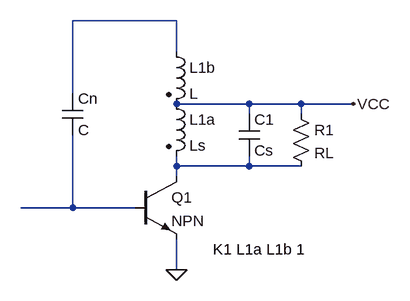
[diagram p0: schematic Estab_base.asc]
Estab_base.asc, the LTspice schematic file:
Version 4
SHEET 1 880 680
WIRE 192 -80 32 -80
WIRE 192 -32 192 -80
WIRE 32 32 32 -80
WIRE 304 48 192 48
WIRE 384 48 304 48
WIRE 464 48 384 48
WIRE 304 64 304 48
WIRE 384 64 384 48
WIRE 192 144 192 128
WIRE 304 144 304 128
WIRE 304 144 192 144
WIRE 384 144 304 144
WIRE 192 160 192 144
WIRE 32 208 32 96
WIRE 32 208 -48 208
WIRE 128 208 32 208
WIRE 192 304 192 256
FLAG 464 48 VCC
FLAG 192 304 0
SYMBOL npn 128 160 R0
SYMATTR InstName Q1
SYMBOL ind2 176 32 R0
SYMATTR InstName L1a
SYMATTR Value Ls
SYMATTR Type ind
SYMBOL ind2 176 -48 R0
SYMATTR InstName L1b
SYMATTR Type ind
SYMBOL cap 16 32 R0
SYMATTR InstName Cn
SYMBOL cap 288 64 R0
SYMATTR InstName C1
SYMATTR Value Cs
SYMBOL res 368 48 R0
SYMATTR InstName R1
SYMATTR Value RL
TEXT 248 272 Left 2 !K1 L1a L1b 1

The netlist it stands for:
* Estab_base.asc
Q1 N002 N003 0 0 NPN
L1a VCC N002 Ls
L1b N001 VCC L
Cn N001 N003 C
C1 VCC N002 Cs
R1 VCC N002 RL
.model NPN NPN
.model PNP PNP
.lib standard.bjt
K1 L1a L1b 1
.backanno
.end